# EAGLE design bt-snes-aa-ncp1402-attiny25-pogo (EAGLE 6.1)
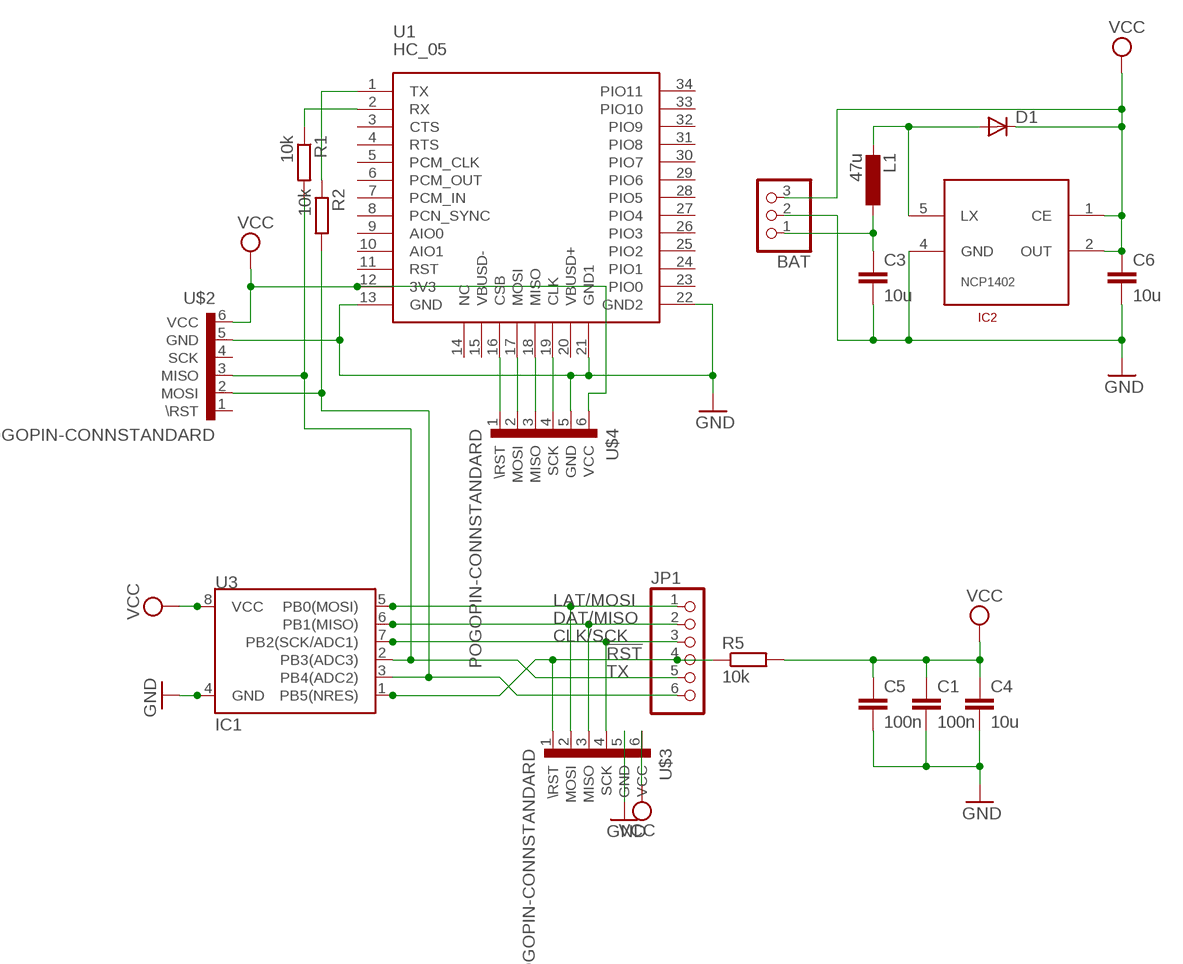
[diagram p0: schematic, sheet 1]

## Parts
BAT  PINHD-1X3  [1X03]
C1  100n  C-EUC0805K  [C0805K]
C3  10u  C-EUC0805K  [C0805K]
C4  10u  C-EUC0805K  [C0805K]
C5  100n  C-EUC0805K  [C0805K]
C6  10u  C-EUC0805K  [C0805K]
D1  DIODE-SOD80C  [SOD80C]
IC2  NCP1402-SOT23-5  [SOT23-5]
JP1  PINHD-1X6  [1X06]
L1  47u  L-EUL1210  [C1210]
R1  10k  R-EU_M0805  [M0805]
R2  10k  R-EU_M0805  [M0805]
R5  10k  R-EU_M0805  [M0805]
U1  HC_05  [BLUETOOTH_SMD]
U3  IC1  ATTINY45TINY45-20-SMT  [SO08-EIAJ]
U$2  POGOPIN-CONNSTANDARD  [POGOPROG-CONN]
U$3  POGOPIN-CONNSTANDARD  [POGOPROG-CONN]
U$4  POGOPIN-CONNSTANDARD  [POGOPROG-CONN]

## Nets
!RST: JP1.4 R5.1 U3.1(PB5(NRES)) U$3.1(\RST)
CLK/SCK: JP1.3 U3.7(PB2(SCK/ADC1)) U$3.4(SCK)
DAT/MISO: JP1.2 U3.6(PB1(MISO)) U$3.3(MISO)
GND: BAT.2 C1.2 C3.2 C4.2 C5.2 C6.2 IC2.4(GND) U1.13(GND) U1.21(GND1) U1.22(GND2) U3.4(GND) U$2.5(GND) U$3.5(GND) U$4.5(GND)
LAT/MOSI: JP1.1 U3.5(PB0(MOSI)) U$3.2(MOSI)
N$1: JP1.6 R2.2 U3.3(PB4(ADC2)) U$2.2(MOSI)
N$2: R1.1 U1.2(RX)
N$5: R2.1 U1.1(TX)
N$6: U1.17(MOSI) U$4.2(MOSI)
N$7: U1.16(CSB) U$4.1(\RST)
N$8: U1.19(CLK) U$4.4(SCK)
N$9: U1.18(MISO) U$4.3(MISO)
N$13: BAT.1 C3.1 L1.1
N$14: D1.A IC2.5(LX) L1.2
TX: JP1.5 R1.2 U3.2(PB3(ADC3)) U$2.3(MISO)
VCC: BAT.3 C1.1 C4.1 C5.1 C6.1 D1.C IC2.1(CE) IC2.2(OUT) R5.2 U1.12(3V3) U3.8(VCC) U$2.6(VCC) U$3.6(VCC) U$4.6(VCC)
Unconnected: U1.3(CTS) U1.4(RTS) U1.5(PCM_CLK) U1.6(PCM_OUT) U1.7(PCM_IN) U1.8(PCN_SYNC) U1.9(AIO0) U1.10(AIO1) U1.11(RST) U1.14(NC) U1.15(VBUSD-) U1.20(VBUSD+) U1.23(PIO0) U1.24(PIO1) U1.25(PIO2) U1.26(PIO3) U1.27(PIO4) U1.28(PIO5) U1.29(PIO6) U1.30(PIO7) U1.31(PIO8) U1.32(PIO9) U1.33(PIO10) U1.34(PIO11) U$2.1(\RST) U$2.4(SCK)

## Library data of the parts
BAT = pinhead:PINHD-1X3: PIN HEADER
C1 C3-C6 = rcl:C-EU: CAPACITOR, European symbol
D1 = diode:DIODE-: DIODE
IC2 = _MY_OWN_LIB:NCP1402
JP1 = pinhead:PINHD-1X6: PIN HEADER
L1 = _MY_OWN_LIB:L-EU: INDUCTOR, European symbol
R1 R2 R5 = rcl:R-EU_: RESISTOR, European symbol
U1 = SerialPortBluetooth:HC_05
U3 = SparkFun-DigitalIC:ATTINY45: Atmel 8-pin 2/4/8kB flash uC; PROD_ID: IC-08922; VALUE: Tiny45-20-SMT
U$2-U$4 = Protofusion:POGOPIN-CONN: Protofusion custom pogo pin programming header

## Board
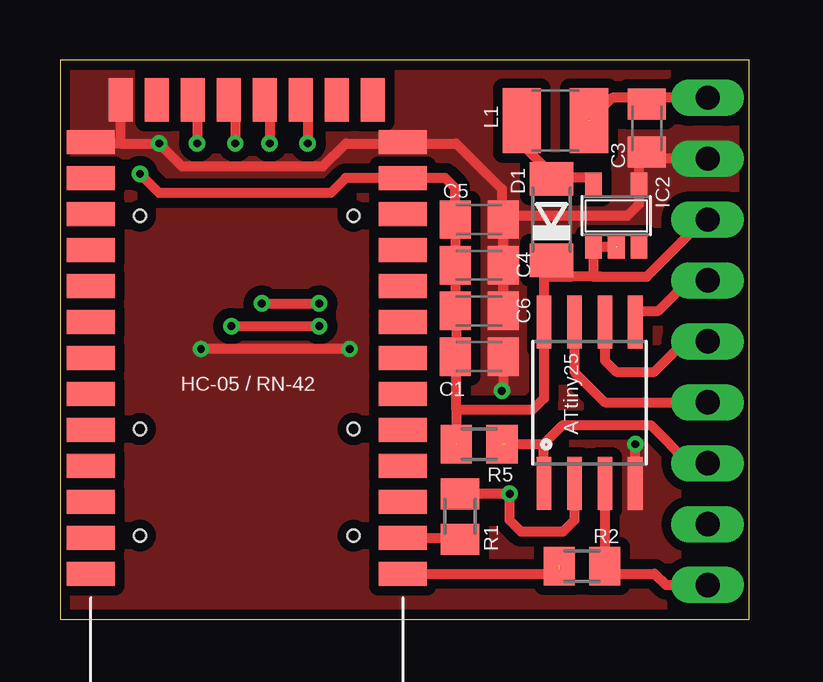
[diagram p1: board, top side]
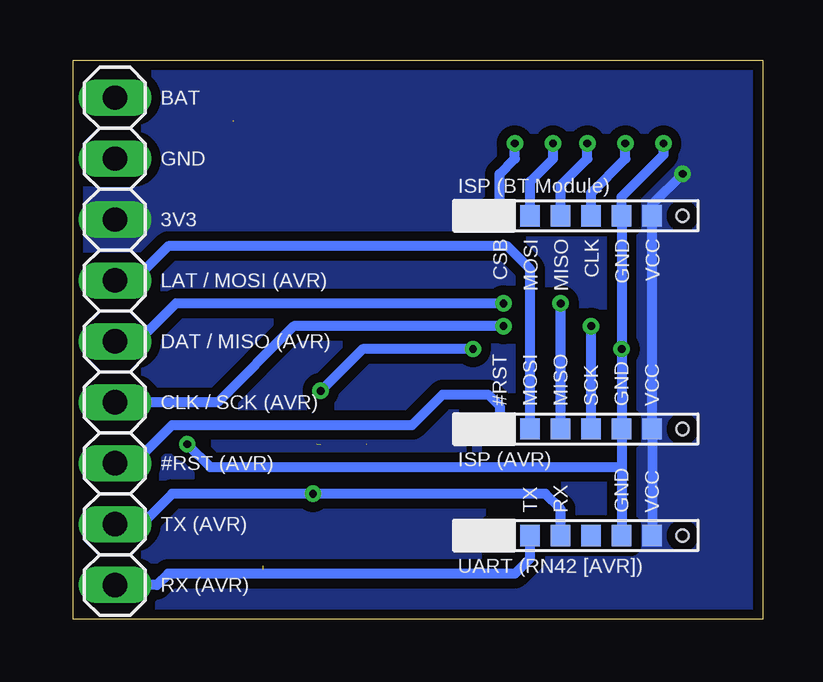
[diagram p2: board, bottom side, seen from below]

Size 28.71 x 23.32 mm. Coordinates in mm from the lower left corner, seen from the top.
Outline: 0,0 28.71,0 28.71,23.32 0,23.32 0,0
Copper layers (1*16): Top 0.0356mm / dielectric 1.5011mm / Bottom 0.0356mm
Design rules: minimum track width 6mil, minimum drill 13mil, track to track 6mil, track to pad 6mil, pad to pad 6mil, via to via 6mil, smd to smd 6mil, copper to edge 15mil, drill to drill 6mil, minimum pad ring 7mil, minimum via ring 7mil, stop-mask expansion 3mil, vias tented up to drill 0mil, thermal gap 10mil

### Footprints (pad centres in the part's own frame; a part is rotated, then mirrored left to right if it is on the bottom)
1X03 = drill 1.016 long: 1 -2.54,0; 2 0,0; 3 2.54,0
C0805K = smd 1.3 x 1.6: 1 -1,0; 2 1,0
SOD80C = smd 1.4 x 1.8: A 1.7,0; C -1.7,0
SOT23-5 = smd 0.69 x 0.99: 1 -0.95,-1.29; 2 0,-1.29; 3 0.95,-1.29; 4 0.95,1.3; 5 -0.95,1.3
1X06 = drill 1.016 long: 1 -6.35,0; 2 -3.81,0; 3 -1.27,0; 4 1.27,0; 5 3.81,0; 6 6.35,0
C1210 = smd 1.6 x 2.7: 1 -1.4,0; 2 1.4,0
M0805 = smd 1.3 x 1.6: 1 -0.95,0; 2 0.95,0
BLUETOOTH_SMD = smd 2 x 1: 1 0,0; 2 0,-1.5; 3 0,-3; 4 0,-4.5; 5 0,-6; 6 0,-7.5; 7 0,-9; 8 0,-10.5; 9 0,-12; 10 0,-13.5; 11 0,-15; 12 0,-16.5; 13 0,-18; 22 13,-18; 23 13,-16.5; 24 13,-15; 25 13,-13.5; 26 13,-12; 27 13,-10.5; 28 13,-9; 29 13,-7.5; 30 13,-6; 31 13,-4.5; 32 13,-3; 33 13,-1.5; 34 13,0 | smd 1 x 1.8: 14 1.25,-19.75; 15 2.75,-19.75; 16 4.25,-19.75; 17 5.75,-19.75; 18 7.25,-19.75; 19 8.75,-19.75; 20 10.25,-19.75; 21 11.75,-19.75
SO08-EIAJ = smd 0.61 x 2.21: 1 -1.905,-3.378; 2 -0.635,-3.378; 3 0.635,-3.378; 4 1.905,-3.378; 5 1.905,3.353; 6 0.635,3.353; 7 -0.635,3.353; 8 -1.905,3.353
POGOPROG-CONN = smd 0.889 x 0.813: 1 0,3.81; 2 0,2.54; 3 0,1.27; 4 0,0; 5 0,-1.27; 6 0,-2.54 | hole 0.508: 0,5.08; 0,-3.81

### Placement (x,y rotation side)
BAT  26.99,19.21 270 bottom
C1  17.46,10.95 0 top
C3  24.45,20.48 270 top
C4  17.46,14.76 0 top
C5  17.46,16.67 0 top
C6  17.46,12.86 0 top
D1  20.48,16.67 90 top
IC2  23.18,16.83 0 top
JP1  26.99,7.78 270 bottom
L1  20.64,20.8 180 top
R1  16.67,4.29 90 top
R2  21.75,2.22 0 top
R5  17.46,7.3 180 top
U1  14.29,1.91 180 top
U3  22.07,9.05 0 top
U$2  7.14,3.49 90 bottom
U$3  7.14,7.94 90 bottom
U$4  7.14,16.83 90 bottom

### Tracks (layer width: path | path; a pad name or v marks a point on that pad's centre or on a via)
!RST  (1 unrouted)
  Top 0.406: 18.57,7.3 20.16,7.3 | U3.1 20.16,7.3 | 20.16,7.3 20.95,8.1 24.61,8.1 26.19,6.51 JP1.4
  Bottom 0.406: JP1.4 26.19,6.51 24.61,8.1 14.61,8.1 13.34,9.37 11.43,9.37 10.95,8.89 U$3.1
CLK/SCK  (via drill 0.33)
  Top 0.406: U3.7 21.43,10.32 22.7,9.05 JP1.3 | v7.14,12.22 v10.79,12.22
  Bottom 0.406: JP1.3 22.7,9.05 19.53,12.22 v10.79,12.22 | U$3.4 v7.14,12.22
DAT/MISO  (via drill 0.33)
  Top 0.406: U3.6 22.7,10.79 23.18,10.32 24.77,10.32 26.04,11.59 JP1.2 | v8.41,13.18 v10.79,13.18
  Bottom 0.406: U$3.3 v8.41,13.18 | v10.79,13.18 24.45,13.18 26.04,11.59 JP1.2
GND  (via drill 0.33, 0.33 pad 0.25)
  Top 0.406: IC2.4 | IC2.4 24.13,19.21 | 24.13,19.21 24.13,19.32 C3.2 | IC2.4 24.13,18.1 24.13,17.3 23.65,16.83 18.62,16.83 C5.2 C4.2 C6.2 18.46,16.62 18.41,16.67 18.41,17.94 16.51,19.84 14.29,19.84 U1.13 14.23,19.84 11.91,19.84 10.95,18.89 5.08,18.89 v4.13,19.84 2.54,19.84 | BAT.2 24.13,19.21 | 2.54,19.84 1.35,19.84 U1.22 | 2.54,19.84 U1.21 | U3.4 v23.97,7.3 | C1.2 18.46,9.73 v18.41,9.53 | v12.06,11.27 v5.87,11.27
  Bottom 0.406: v4.13,19.84 4.13,19.37 5.87,17.62 U$4.5 v5.87,11.27 U$3.5 5.87,6.35 | 5.87,6.35 U$2.5 | v23.97,7.3 23.02,6.35 5.87,6.35 | v12.06,11.27 16.67,11.27 v18.41,9.53
  pour Top (isolate 0.406, no thermals): 0,23.34 28.73,23.34 28.73,0 0,0
LAT/MOSI
  Top 0.406: U3.5 23.97,12.86 24.92,12.86 26.19,14.13 JP1.1
  Bottom 0.406: JP1.1 26.19,14.13 24.77,15.56 10.64,15.56 9.68,14.61 U$3.2
N$1
  Top 0.406: U3.3 22.7,2.07 | 22.7,2.07 R2.2 | JP1.6 25.24,1.43 24.77,1.91 22.7,1.91 22.7,2.07
  Bottom 0.406: U$2.2 9.68,2.54 10.32,1.91 24.77,1.91 25.24,1.43 JP1.6
N$2
  Top 0.406: U1.2 16.44,3.4 R1.1
N$5  (1 unrouted)
  Top 0.406: U1.1 20.64,1.91 20.8,2.06
N$6  (via drill 0.33)
  Top 0.406: U1.17 8.73,21.66 v8.73,19.84
  Bottom 0.406: U$4.2 9.68,18.26 8.73,19.21 v8.73,19.84
N$7  (via drill 0.33)
  Top 0.406: U1.16 10.32,21.66 v10.32,19.84
  Bottom 0.406: U$4.1 10.95,18.57 10.32,19.21 v10.32,19.84
N$8  (via drill 0.33)
  Top 0.406: U1.19 5.71,21.66 v5.71,19.84
  Bottom 0.406: U$4.4 7.14,17.78 5.71,19.21 v5.71,19.84
N$9  (via drill 0.33)
  Top 0.406: U1.18 7.3,21.66 v7.3,19.84
  Bottom 0.406: U$4.3 8.41,18.1 7.3,19.21 v7.3,19.84
N$13  (1 unrouted)
  Top 0.406: BAT.1 24.45,21.75 | 24.45,21.75 23.02,21.75 22.07,20.8 | C3.1 24.45,21.75
N$14
  Top 0.406: 20.48,18.41 20.84,18.41 D1.A 20.48,18.41 | 22.2,18.13 22.23,18.1 | 20.56,18.49 20.64,18.41 22.23,18.41 22.2,18.13 | 20.56,18.49 19.21,19.84 19.24,19.87 L1.2 | IC2.5 22.2,18.13 | 20.48,18.41 20.56,18.49
TX  (via drill 0.33 pad 0.25)
  Top 0.406: U3.2 21.43,4.13 20.95,3.65 19.21,3.65 18.73,4.13 v18.73,5.24 18.42,5.24 R1.2
  Bottom 0.406: U$2.3 8.41,4.6 9.05,5.24 v18.73,5.24 24.61,5.24 25.88,3.97 JP1.5
VCC  (via drill 0.33)  (1 unrouted)
  Top 0.406: 21.32,14.29 22.54,14.29 22.23,14.29 | 21.32,14.29 20.16,14.29 U3.8 20.16,9.21 19.68,8.73 16.51,8.73 | 21.32,14.29 D1.C | 22.23,14.29 IC2.1 IC2.2 | 22.23,14.29 24.45,14.29 26.83,16.67 BAT.3 | R5.2 16.51,8.73 | v3.33,18.57 4.13,17.78 11.27,17.78 11.9,18.41 U1.12 16.03,18.41 16.46,17.99 C5.1 C4.1 C6.1 16.51,12.81 16.51,10.74 | 16.51,8.73 16.51,10.74 | 16.51,10.74 C1.1
  Bottom 0.406: v3.33,18.57 4.6,17.3 U$4.6 U$3.6 U$2.6
  pour Bottom (isolate 0.406, no thermals): 0,0 28.73,0 28.73,23.34 0,23.34

### Text on the board
tNames: ATtiny25 | HC-05 / RN-42
bNames: BAT | GND | ISP (BT Module) | 3V3 | VCC | GND | CLK | MISO | MOSI | CSB | LAT / MOSI (AVR) | DAT / MISO (AVR) | VCC | GND | SCK | MISO | MOSI | #RST | CLK / SCK (AVR) | ISP (AVR) | #RST (AVR) | VCC | GND | RX | TX | TX (AVR) | UART (RN42 [AVR]) | RX (AVR)